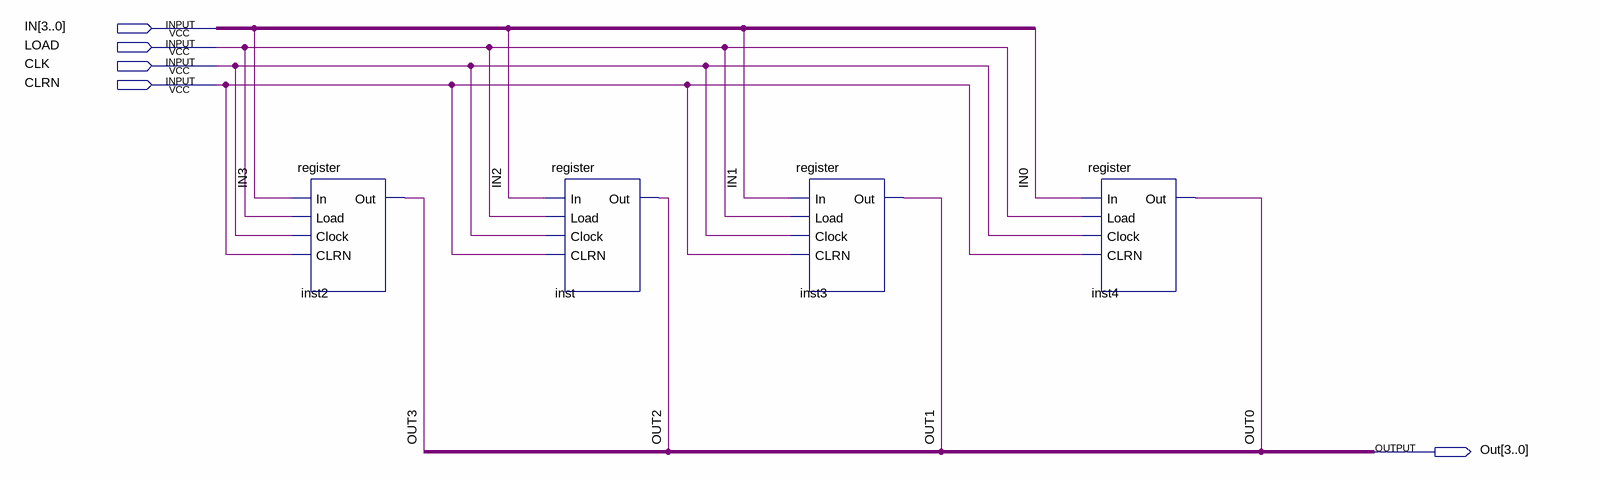
[diagram p0: schematic sheet]
// Quartus schematic reg4b.bdf as structural Verilog: 4 symbols, 5 pins
module reg4b (
  input  [3:0] IN,
  input  LOAD,
  input  CLK,
  input  CLRN,
  output [3:0] Out
);

  register inst2 (.In(IN[3]), .Load(LOAD), .Clock(CLK), .CLRN(CLRN), .Out(Out[3]));
  register inst (.In(IN[2]), .Load(LOAD), .Clock(CLK), .CLRN(CLRN), .Out(Out[2]));
  register inst3 (.In(IN[1]), .Load(LOAD), .Clock(CLK), .CLRN(CLRN), .Out(Out[1]));
  register inst4 (.In(IN[0]), .Load(LOAD), .Clock(CLK), .CLRN(CLRN), .Out(Out[0]));
endmodule
